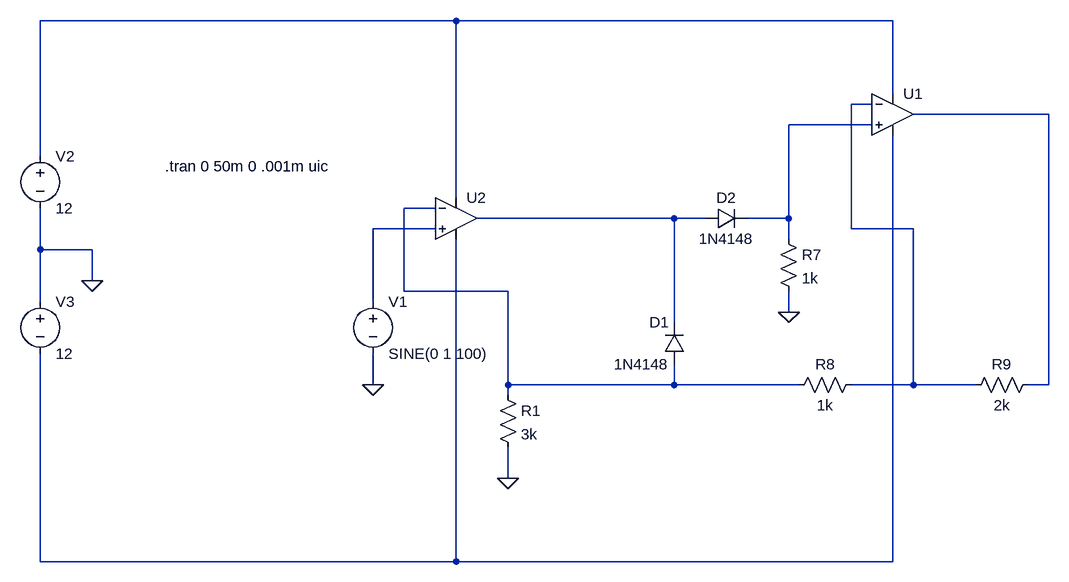
[diagram p0: schematic ondacompleta.asc]
ondacompleta.asc, the LTspice schematic file:
Version 4
SHEET 1 1748 680
WIRE 832 -240 192 -240
WIRE 1504 -240 832 -240
WIRE 1504 -128 1504 -240
WIRE 1472 -112 1440 -112
WIRE 1744 -96 1536 -96
WIRE 1472 -80 1344 -80
WIRE 192 -32 192 -240
WIRE 832 32 832 -240
WIRE 800 48 752 48
WIRE 1168 64 864 64
WIRE 1216 64 1168 64
WIRE 1344 64 1344 -80
WIRE 1344 64 1280 64
WIRE 800 80 704 80
WIRE 1440 80 1440 -112
WIRE 1536 80 1440 80
WIRE 1344 96 1344 64
WIRE 192 112 192 48
WIRE 272 112 192 112
WIRE 272 160 272 112
WIRE 752 176 752 48
WIRE 912 176 752 176
WIRE 192 192 192 112
WIRE 704 192 704 80
WIRE 1344 208 1344 176
WIRE 1168 224 1168 64
WIRE 704 320 704 272
WIRE 912 320 912 176
WIRE 1168 320 1168 288
WIRE 1168 320 912 320
WIRE 1360 320 1168 320
WIRE 1536 320 1536 80
WIRE 1536 320 1440 320
WIRE 1632 320 1536 320
WIRE 1744 320 1744 -96
WIRE 1744 320 1712 320
WIRE 912 336 912 320
WIRE 912 464 912 416
WIRE 192 592 192 272
WIRE 832 592 832 96
WIRE 832 592 192 592
WIRE 1504 592 1504 -64
WIRE 1504 592 832 592
FLAG 912 464 0
FLAG 1344 208 0
FLAG 704 320 0
FLAG 272 160 0
SYMBOL diode 1184 288 R180
WINDOW 0 24 64 Left 2
WINDOW 3 24 0 Left 2
SYMATTR InstName D1
SYMATTR Value 1N4148
SYMBOL diode 1216 80 R270
WINDOW 0 32 32 VTop 2
WINDOW 3 0 32 VBottom 2
SYMATTR InstName D2
SYMATTR Value 1N4148
SYMBOL res 1328 80 R0
SYMATTR InstName R7
SYMATTR Value 1k
SYMBOL res 1456 304 R90
WINDOW 0 0 56 VBottom 2
WINDOW 3 32 56 VTop 2
SYMATTR InstName R8
SYMATTR Value 1k
SYMBOL res 1728 304 R90
WINDOW 0 0 56 VBottom 2
WINDOW 3 32 56 VTop 2
SYMATTR InstName R9
SYMATTR Value 2k
SYMBOL voltage 704 176 R0
WINDOW 123 0 0 Left 2
WINDOW 39 0 0 Left 2
SYMATTR InstName V1
SYMATTR Value SINE(0 1 100)
SYMBOL Opamps\\UniversalOpamp2 1504 -96 R0
SYMATTR InstName U1
SYMBOL Opamps\\UniversalOpamp2 832 64 R0
SYMATTR InstName U2
SYMBOL voltage 192 -48 R0
WINDOW 123 0 0 Left 2
WINDOW 39 0 0 Left 2
SYMATTR InstName V2
SYMATTR Value 12
SYMBOL voltage 192 176 R0
WINDOW 123 0 0 Left 2
WINDOW 39 0 0 Left 2
SYMATTR InstName V3
SYMATTR Value 12
SYMBOL res 896 320 R0
SYMATTR InstName R1
SYMATTR Value 3k
TEXT 384 -16 Left 2 !.tran 0 50m 0 .001m uic

The netlist it stands for:
* ondacompleta.asc
D1 N005 N006 1N4148
D2 N006 N004 1N4148
R7 N004 0 1k
R8 N002 N005 1k
R9 N003 N002 2k
V1 N007 0 SINE(0 1 100)
XU1 N004 N002 N001 N008 N003 level.2 Avol=1Meg GBW=10Meg Slew=10Meg ilimit=25m rail=0 Vos=0 phimargin=45 en=0 enk=0 in=0 ink=0 Rin=500Meg  ; pins IN+ IN- V+ V- OUT
XU2 N007 N005 N001 N008 N006 level.2 Avol=1Meg GBW=10Meg Slew=10Meg ilimit=25m rail=0 Vos=0 phimargin=45 en=0 enk=0 in=0 ink=0 Rin=500Meg  ; pins IN+ IN- V+ V- OUT
V2 N001 0 12
V3 0 N008 12
R1 N005 0 3k
.model D D
.lib standard.dio
.tran 0 50m 0 .001m uic
.lib UniversalOpamps2.sub
.backanno
.end